# Altium schematic sheet Sitara_rev1.SchDoc
size A4; CompanyName: SPAN; Engineer: Anh Luong; Organization: University of Utah; Address1: 50 S Central Campus Dr; Address2: MEB Rm 3129; Address3: Salt Lake City, Utah 84115; Address4: USA; Revision: 1; SheetNumber: 1; SheetTotal: 1
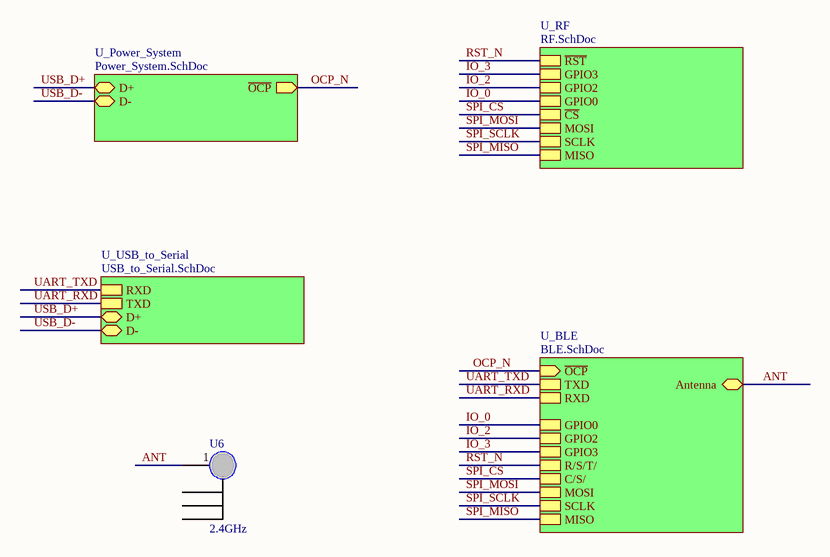
[diagram p0: Sitara_rev1.SchDoc]

## Parts
U6  2.4GHz  [ANT_molex_2_4_GHz]

## Sub-sheets
U_BLE = BLE.SchDoc: ~{OCP} (in), TXD, RXD, Antenna (bidir), GPIO0, GPIO2, GPIO3, R/S/T/, C/S/, MOSI, SCLK, MISO
U_Power_System = Power_System.SchDoc: D+ (bidir), D- (bidir), ~{OCP} (out)
U_RF = RF.SchDoc: ~{RST}, GPIO3, GPIO2, GPIO0, ~{CS}, MOSI, SCLK, MISO
U_USB_to_Serial = USB_to_Serial.SchDoc: RXD, TXD, D+ (bidir), D- (bidir)

## Nets
ANT: U6.1 ; sheet U_BLE/Antenna
IO_0: sheet U_RF/GPIO0, sheet U_BLE/GPIO0
IO_2: sheet U_RF/GPIO2, sheet U_BLE/GPIO2
IO_3: sheet U_RF/GPIO3, sheet U_BLE/GPIO3
OCP_N: sheet U_BLE/~{OCP}, sheet U_Power_System/~{OCP}
RST_N: sheet U_RF/~{RST}, sheet U_BLE/R/S/T/
SPI_CS: sheet U_RF/~{CS}, sheet U_BLE/C/S/
SPI_MISO: sheet U_RF/MISO, sheet U_BLE/MISO
SPI_MOSI: sheet U_RF/MOSI, sheet U_BLE/MOSI
SPI_SCLK: sheet U_RF/SCLK, sheet U_BLE/SCLK
UART_RXD: sheet U_BLE/RXD, sheet U_USB_to_Serial/TXD
UART_TXD: sheet U_BLE/TXD, sheet U_USB_to_Serial/RXD
USB_D+: sheet U_Power_System/D+, sheet U_USB_to_Serial/D+
USB_D-: sheet U_Power_System/D-, sheet U_USB_to_Serial/D-

Not connected (* = marked no-connect by the designer): U6 2 3 4

## Notes on the sheet
- Title
- Designed by:
- Date:
- Time:
- Revision:
- Sheet
- of
- File:

## Library data of the parts
U6 = 0479480001: ANTENNA 2.4GHZ 50 OHMS SMD; Manufacturer: Molex, LLC; Frequency Group: UHF (2 GHz ~ 3 GHz); Frequency Range: 2.4GHz ~ 2.483.5GHz; Antenna Type: Chip; Number of Bands: 1; Return Loss: -9dB; Gain: 3dBi; Power - Max: 2W; Supplier 1: Digi-Key; Manufacturer Part Number: 0479480001; RoHS: RoHS Compliant; Category: RF/IF and RFID; Stock 1: 3600; Pricing 1: 1800=0.73695, 3600=0.68782, 5400=0.65343, 12600=0.62886, 45000=0.60921, 90000=0.58956 (USD); Packaging: Tape & Reel (TR); Part Status: Active; Frequency (Center/Band): 2.4GHz; VSWR: -; Features: -; Termination: Solder; Ingress Protection: -; Mounting Type: Surface Mount; Height (Max): 0.157" (4.00mm); Applications: Bluetooth, WLAN, Zigbee™; ComponentLink1URL: http://www.molex.com/pdm_docs/sd/479480001_sd.pdf; ComponentLink1Description: http://www.molex.com/pdm_docs/sd/479480001_sd.pdf; Supplier Part Number 1: WM4893TR-ND